# Altium project HU_revB.PrjPcb (part 2 of 2)

## Sheet NVME.SchDoc
size C; SheetNumber: 6; SheetTotal: 17
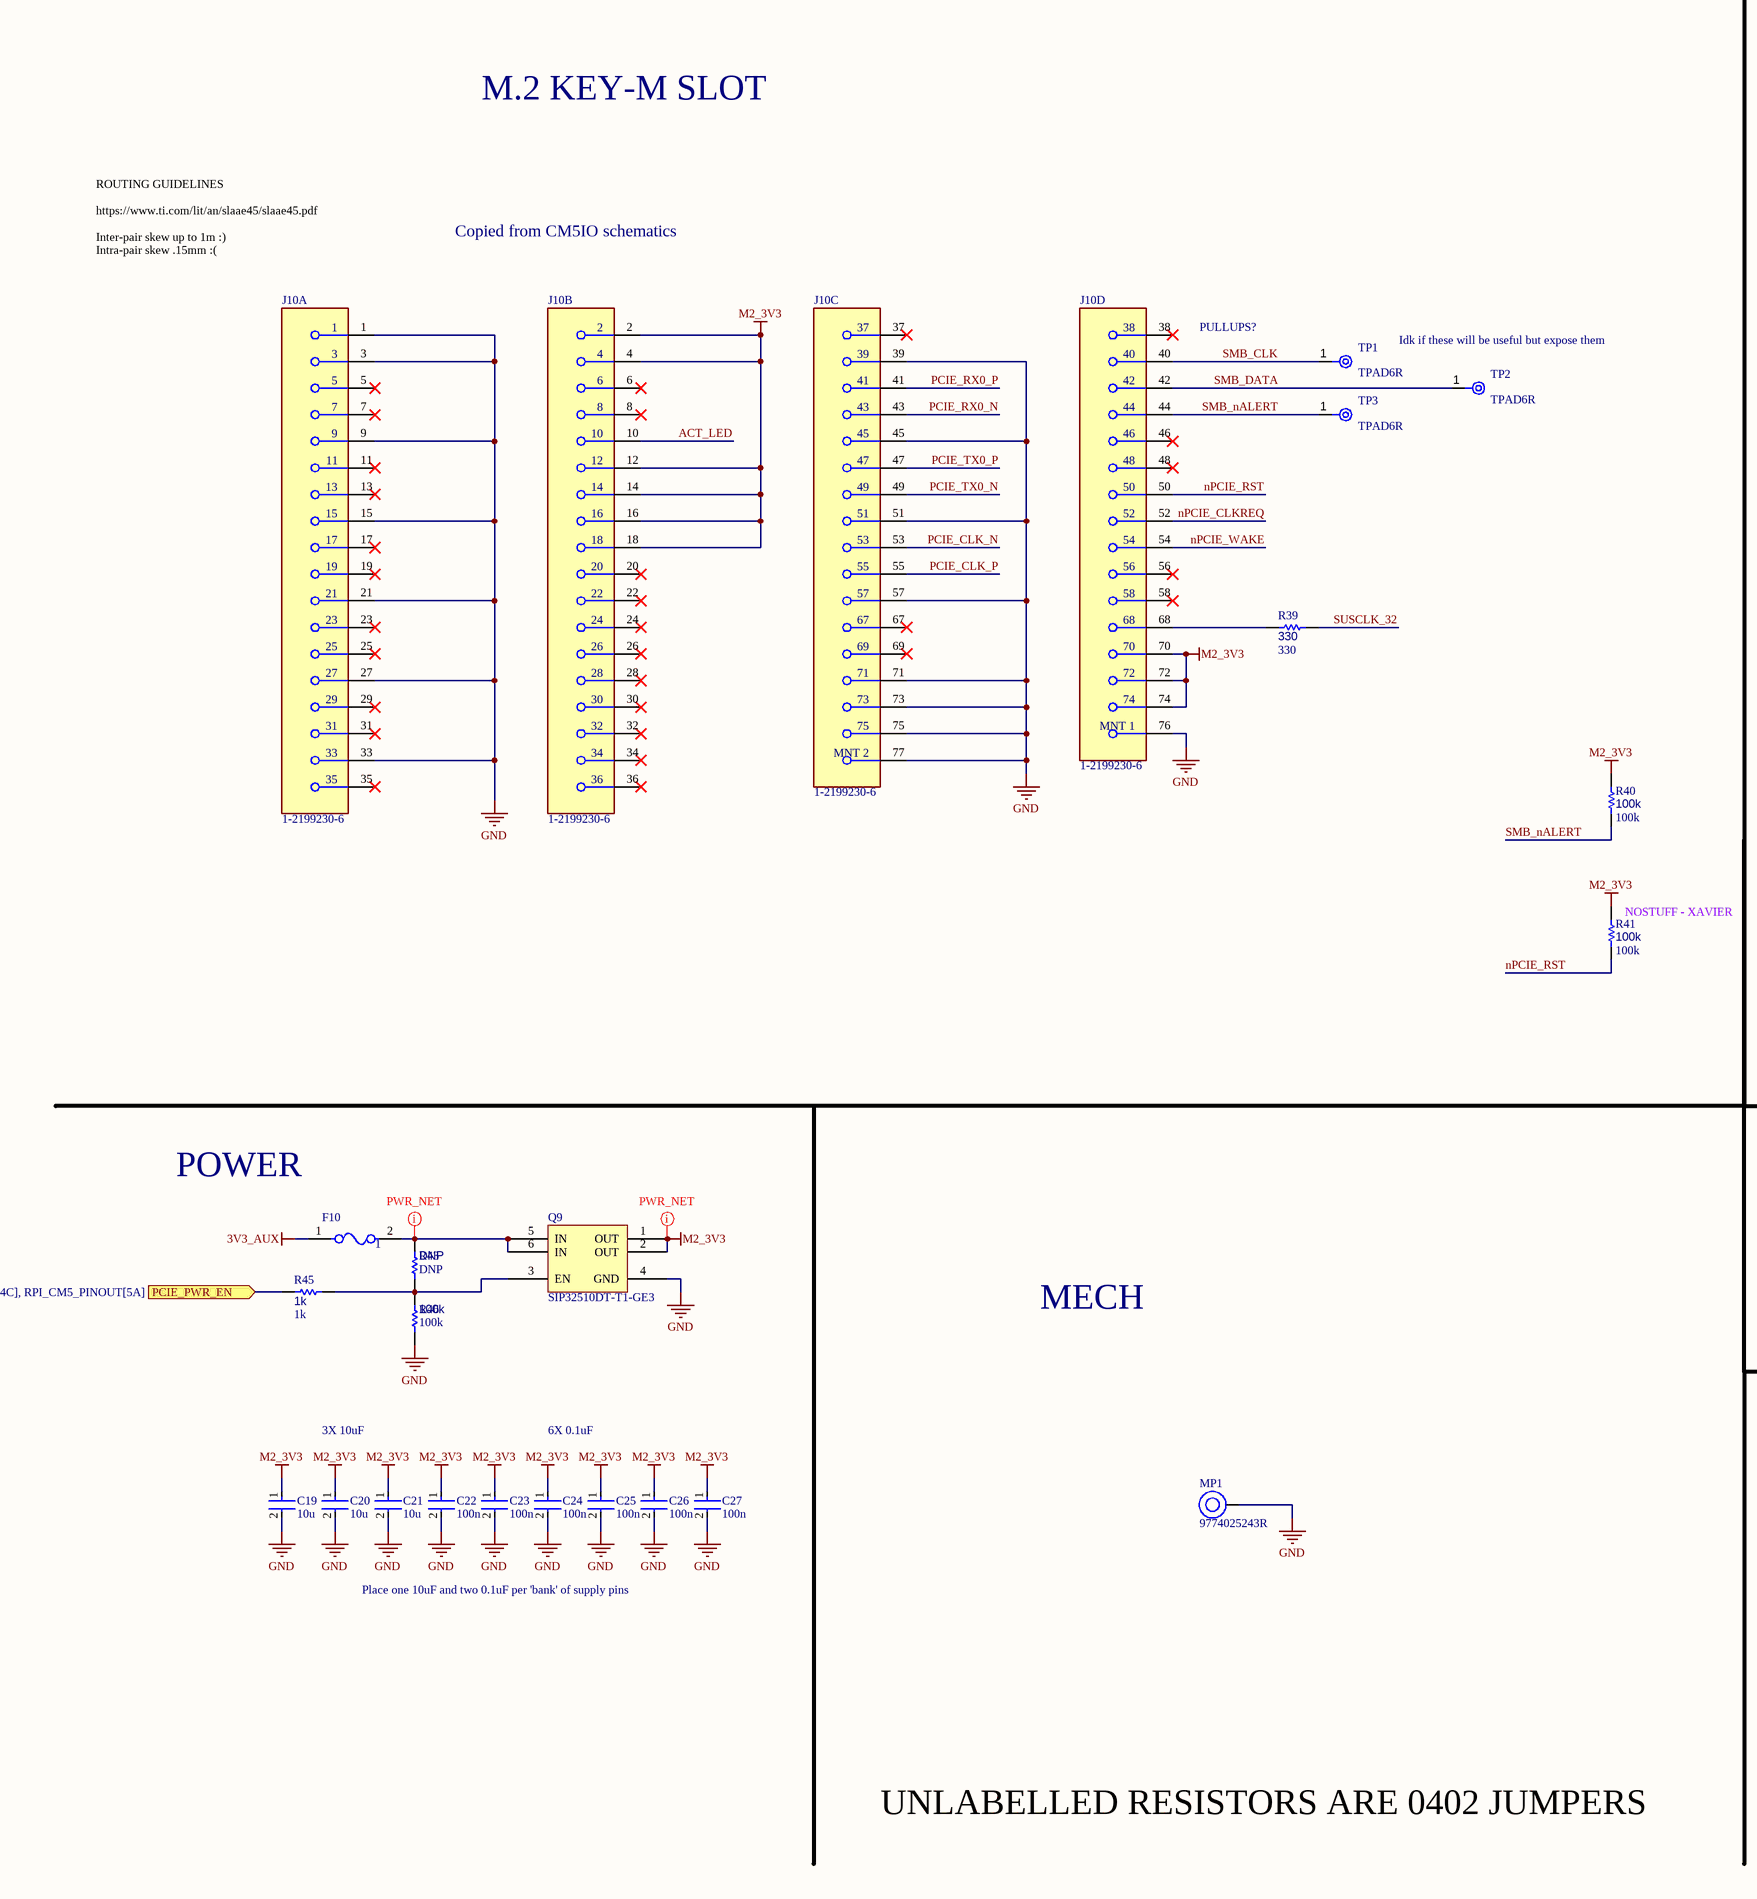
[diagram p6: NVME.SchDoc, left]
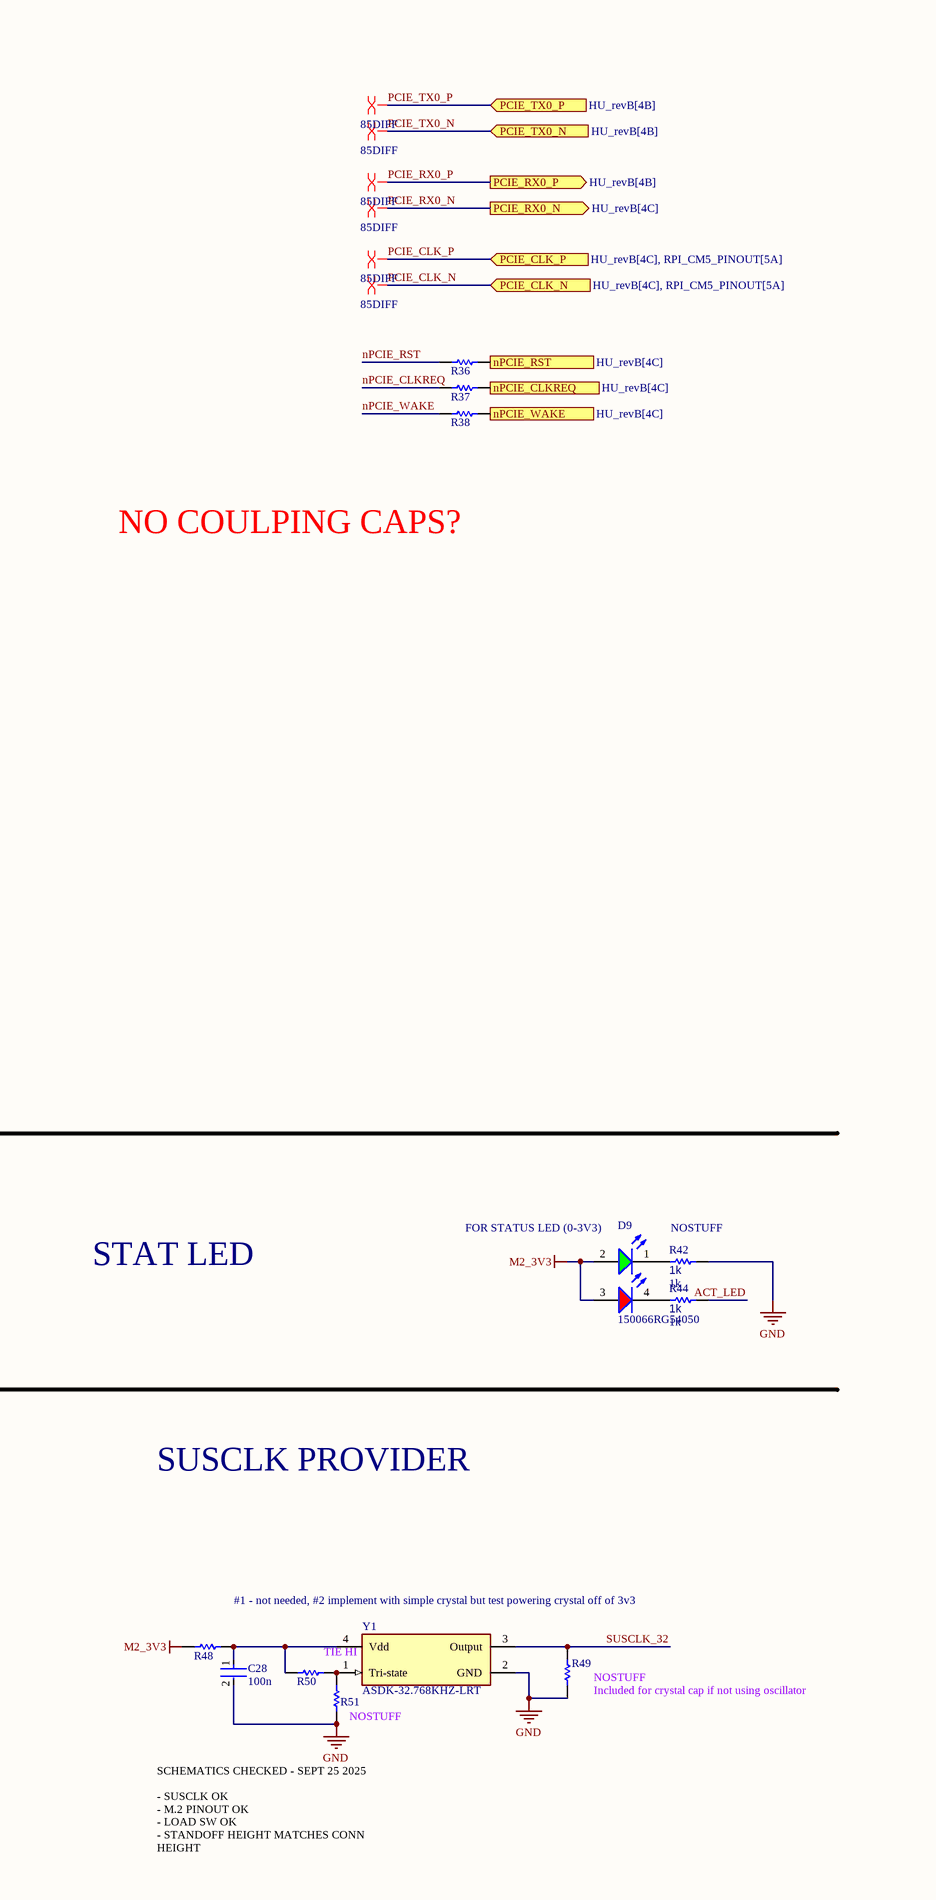
[diagram p7: NVME.SchDoc, right]

### Parts
C19  10u  [FP-0402-L_1_0_0_05-W_0_5-IPC_A]
C20  10u  [FP-0402-L_1_0_0_05-W_0_5-IPC_A]
C21  10u  [FP-0402-L_1_0_0_05-W_0_5-IPC_A]
C22  100n  [FP-0402-L_1_0_0_05-W_0_5-IPC_A]
C23  100n  [FP-0402-L_1_0_0_05-W_0_5-IPC_A]
C24  100n  [FP-0402-L_1_0_0_05-W_0_5-IPC_A]
C25  100n  [FP-0402-L_1_0_0_05-W_0_5-IPC_A]
C26  100n  [FP-0402-L_1_0_0_05-W_0_5-IPC_A]
C27  100n  [FP-0402-L_1_0_0_05-W_0_5-IPC_A]
C28  100n  [FP-0402-L_1_0_0_05-W_0_5-IPC_A]
D9  150066RG54050  [WL-SBCD_0606]
F10  1  [FP-0685T-MFG]
J10  1-2199230-6  [FP-1-2199230-6-MFG]  (parts A,B,C,D of 4)
MP1  9774025243R  [9774025243]
Q9  SIP32510DT-T1-GE3  [SOT95P284X110-6N]
R36  0402 JUMPER  [RESC1005X40X25ML05T05]  (value not drawn)
R37  0402 JUMPER  [RESC1005X40X25ML05T05]  (value not drawn)
R38  0402 JUMPER  [RESC1005X40X25ML05T05]  (value not drawn)
R39  330  [R0603B]
R40  100k  [R0603B]
R41  100k  [R0603B]
R42  1k  [R0603B]
R43  DNP  [R0603B]
R44  1k  [R0603B]
R45  1k  [R0603B]
R46  100k  [R0603B]
R48  0402 JUMPER  [RESC1005X40X25ML05T05]  (value not drawn)
R49  0402 JUMPER  [RESC1005X40X25ML05T05]  (value not drawn)
R50  0402 JUMPER  [RESC1005X40X25ML05T05]  (value not drawn)
R51  0402 JUMPER  [RESC1005X40X25ML05T05]  (value not drawn)
TP1  TPAD6R  [New footprint 1]
TP2  TPAD6R  [New footprint 1]
TP3  TPAD6R  [New footprint 1]
Y1  ASDK-32.768KHZ-LRT  [FP-ASDK-MFG]

### Ports
nPCIE_CLKREQ (out, see HU_revB[4C]), nPCIE_RST (in, see HU_revB[4C]), nPCIE_WAKE (out, see HU_revB[4C]), PCIE_CLK_N (in, see HU_revB[4C], RPI_CM5_PINOUT[5A]), PCIE_CLK_P (in, see HU_revB[4C], RPI_CM5_PINOUT[5A]), PCIE_PWR_EN (in, see HU_revB[4C], RPI_CM5_PINOUT[5A]), PCIE_RX0_N (out, see HU_revB[4C]), PCIE_RX0_P (out, see HU_revB[4B]), PCIE_TX0_N (in, see HU_revB[4B]), PCIE_TX0_P (in, see HU_revB[4B])

### Nets
3V3_AUX: F10.1
GND: C19.2 C20.2 C21.2 C22.2 C23.2 C24.2 C25.2 C26.2 C27.2 C28.2 J10.1 J10.3 J10.9 J10.15 J10.21 J10.27 J10.33 J10.39 J10.45 J10.51 J10.57 J10.71 J10.73 J10.75 J10.76(MNT_1) J10.77(MNT_2) MP1.1 Q9.4(GND) R42.2 R46.1 R49.1 R51.1 Y1.2(GND)
M2_3V3: C19.1 C20.1 C21.1 C22.1 C23.1 C24.1 C25.1 C26.1 C27.1 D9.2(A) D9.3(A) J10.2 J10.4 J10.12 J10.14 J10.16 J10.18 J10.70 J10.72 J10.74 Q9.1(OUT) Q9.2(OUT) R40.1 R41.1 R48.1
ACT_LED: J10.10 R44.2
nPCIE_CLKREQ: J10.52 R37.1
nPCIE_RST: J10.50 R36.1 R41.2
nPCIE_WAKE: J10.54 R38.1
PCIE_CLK_N: J10.53 ; port PCIE_CLK_N
PCIE_CLK_P: J10.55 ; port PCIE_CLK_P
PCIE_RX0_N: J10.43 ; port PCIE_RX0_N
PCIE_RX0_P: J10.41 ; port PCIE_RX0_P
PCIE_TX0_N: J10.49 ; port PCIE_TX0_N
PCIE_TX0_P: J10.47 ; port PCIE_TX0_P
SMB_CLK: J10.40 TP1.1(TP)
SMB_DATA: J10.42 TP2.1(TP)
SMB_nALERT: J10.44 R40.2 TP3.1(TP)
SUSCLK_32: R39.1 R49.2 Y1.3(Output)
NetC28_1: C28.1 R48.2 R50.1 Y1.4(Vdd)
NetD9_1: D9.1(K) R42.1
NetD9_4: D9.4(K) R44.1
NetF10_2: F10.2 Q9.5(IN) Q9.6(IN) R43.2
NetJ10_68: J10.68 R39.2
NetQ9_3: Q9.3(EN) R43.1 R45.1 R46.2
NetR36_2: R36.2 ; port nPCIE_RST
NetR37_2: R37.2 ; port nPCIE_CLKREQ
NetR38_2: R38.2 ; port nPCIE_WAKE
NetR45_2: R45.2 ; port PCIE_PWR_EN
NetR50_2: R50.2 R51.2 Y1.1(Tri-state)

Not connected (* = marked no-connect by the designer): J10 5* 6* 7* 8* 11* 13* 17* 19* 20* 22* 23* 24* 25* 26* 28* 29* 30* 31* 32* 34* 35* 36* 37* 38* 46* 48* 56* 58* 67* 69*

### Layout directives
differential pair; differential pair class 85DIFF: PCIE_CLK_N, PCIE_CLK_P, PCIE_RX0_N, PCIE_RX0_P, PCIE_TX0_N, PCIE_TX0_P
net class PWR: M2_3V3, NetF10_2

### Notes on the sheet
- M.2 KEY-M SLOT
- ROUTING GUIDELINES
  https://www.ti.com/lit/an/slaae45/slaae45.pdf
  Inter-pair skew up to 1m :)
  Intra-pair skew .15mm :(
- Copied from CM5IO schematics
- PULLUPS?
- (near TP2) Idk if these will be useful but expose them
- NO COULPING CAPS?
- (near R41) NOSTUFF - XAVIER
- POWER
- STAT LED
- (near D9) FOR STATUS LED (0-3V3)
- (near R42) NOSTUFF
- MECH
- 3X 10uF
- 6X 0.1uF
- SUSCLK PROVIDER
- Place one 10uF and two 0.1uF per 'bank' of supply pins
- #1 - not needed, #2 implement with simple crystal but test powering crystal off of 3v3
- (near Y1) TIE HI
- (near R51) NOSTUFF
- (near R49) NOSTUFF
- (near R49) Included for crystal cap if not using oscillator
- UNLABELLED RESISTORS ARE 0402 JUMPERS
- SCHEMATICS CHECKED - SEPT 25 2025
  - SUSCLK OK
  - M.2 PINOUT OK
  - LOAD SW OK
  - STANDOFF HEIGHT MATCHES CONN HEIGHT

### Library data of the parts
C19-C28 = CMP-001-00058-1: LARGE PADS, 0402 CAP, CHANGE COMMENT TO MATCH REAL P/N; Capacitor Type: Ceramic; Min Operating Temperature: -55°C; Mounting Technology: Surface Mount; Pins: 2; Case/Package: 0402; RoHS Compliant: Yes; Max Operating Temperature: 85°C
D9 = CMP-004-00040-2: Led, Red/Grn, 180Mcd/230Mcd, 624Nm/525Nm Rohs Compliant: Yes; Source: rgled.SchLib; Component Type: Standard; Pins: 4; Design Item ID: CMP-004-00034-2
F10 = CMP-16042-000006-1: FUSE BOARD MNT 5A 63VAC/VDC 1206; RoHS Compliant: Yes
J10 = CMP-03365-000001-1: CONN EDGE DUAL FMALE 67POS 0.020; Manufacturer: TE; Number Of Contacts: 67; Current Rating: 0.5A; Pitch: 0.5mm; Conn Gender: Female; Is Female: yes; Voltage Rating: 50V; Conn Orientation: Right Angle; Automotive: No; Temperature Range High: +80°C; Package: 1-2199230-6; Category: Conn; Temperature: -40°C to +80°C; Number Of Rows: 2; ComponentLink2URL: http://www.te.com/commerce/DocumentDelivery/DDEController?Action=showdoc&DocId=Specification+Or+Standard%7F114-115006%7FB%7Fpdf%7FEnglish%7FENG_SS_114-115006_B_114-115006_REV_B.pdf%7F1-2199230-6; Manufacturer Part Number: 1-2199230-6; Height: 4.2mm; RoHS: TRUE; Footprint Url: http://www.te.com/commerce/DocumentDelivery/DDEController?Action=showdoc&DocId=Customer+Drawing%7F2199230%7FB2%7Fpdf%7FEnglish%7FENG_CD_2199230_B2.pdf%7F1-2199230-6; Digikey Description: CONN EDGE DUAL FMALE 67POS 0.020; Device Class L2: Card Edge Connectors; Contact Material: Gold,Tin; Device Class L1: Connectors; Device Class L3: unset; ComponentLink2Description: Datasheet; Temperature Range Low: -40°C; Octopart: https://octopart.com/1-2199230-6-te+connectivity-34969376; Lead Free: Yes
MP1 = CMP-03913-59774857-1: 9774025243R Spacer Material: Steel, Tin-Plated Mounting: SMT Series: WA-SMST Thread D: M2; Outside Diameter: 4.3434mm; Threaded/Unthreaded: Threaded; Plating: Tin; REACH SVHC: Unknown; NexarPartId: 59774857; RoHS: Compliant; Material: Steel; Packaging: Tape and Reel; Max Operating Temperature: 150°C; Min Operating Temperature: -55°C; Length: 2.5mm; Height: 2.5mm
Q9 = CMP-019-00054-1: Power Switch ICs – Power Distribution; VISHAY; SIP32510DT-T1-GE3; 1; 1; 5.5 V; SOT-23-6; Max Supply Voltage: 5.5V; Max Power Dissipation: 833mW; Min Supply Voltage: 1.2V; Case/Package: SOT-23-6; Mounting Technology: Surface Mount; Max Operating Temperature: 85°C; Min Operating Temperature: -40°C
R36-R38 R48-R51 = CMP-009-00118-2: READ THE NAME; Pins: 2; Component Type: Standard; Design Item ID: CMP-009-00206-2; Source: 0402jump.SchLib
R39-R46 = CMP-009-00002-14: Resistor
  R39: Value: 330
  R40 R41 R46: Value: 100k
  R42 R44 R45: Value: 1k
  R43: Value: DNP
TP1-TP3 = CMP-00025-2: Test Point .6mm
Y1 = CMP-27762-001115-1: XTAL OSC XO 32.7680KHZ CMOS SMD; Load Capacitance: 15pF; Max Supply Current: 3.5mA; Min Supply Voltage: 2.97V; Operating Supply Voltage: 3.3V; Frequency Stability: 25ppm; Lead Free: Lead Free; Case/Package: CSMD; Number of Pins: 4; Max Operating Temperature: 85°C; Packaging: Tape and Reel; Width: 0.079inch; Min Operating Temperature: -40°C; Radiation Hardening: No; Length: 2.5mm; Depth: 2mm; Termination: SMD/SMT; Height: 0.037inch; Series: ASDK; Frequency: 32.768kHz; Mount: Surface Mount

## Sheet MCP2515_PINOUT.SchDoc
size A; SheetNumber: 7; SheetTotal: 17
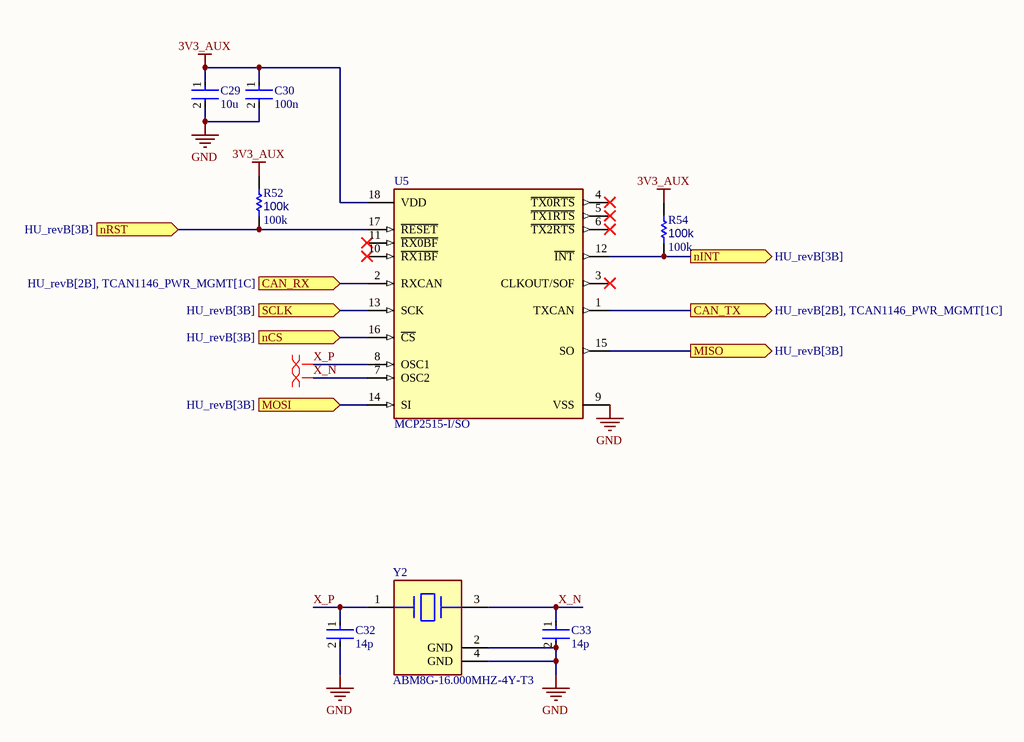
[diagram p8: MCP2515_PINOUT.SchDoc]

### Parts
C29  10u  [FP-0402-L_1_0_0_05-W_0_5-IPC_A]
C30  100n  [FP-0402-L_1_0_0_05-W_0_5-IPC_A]
C32  14p  [FP-0402-L_1_0_0_05-W_0_5-IPC_A]
C33  14p  [FP-0402-L_1_0_0_05-W_0_5-IPC_A]
R52  100k  [R0603B]
R54  100k  [R0603B]
U5  MCP2515-I/SO  [FP-C04-051-MFG]
Y2  ABM8G-16.000MHZ-4Y-T3  [FP-ABM8G-MFG]

### Ports
CAN_RX (in, see HU_revB[2B], TCAN1146_PWR_MGMT[1C]), CAN_TX (out, see HU_revB[2B], TCAN1146_PWR_MGMT[1C]), MISO (out, see HU_revB[3B]), MOSI (in, see HU_revB[3B]), nCS (in, see HU_revB[3B]), nINT (out, see HU_revB[3B]), nRST (in, see HU_revB[3B]), SCLK (in, see HU_revB[3B])

### Nets
3V3_AUX: C29.1 C30.1 R52.1 R54.1 U5.18(VDD)
GND: C29.2 C30.2 C32.2 C33.2 U5.9(VSS) Y2.2(GND) Y2.4(GND)
X_N: C33.1 U5.7(OSC2) Y2.3
X_P: C32.1 U5.8(OSC1) Y2.1
NetR52_2: R52.2 U5.17(~{RESET}) ; port nRST
NetR54_2: R54.2 U5.12(~{INT}) ; port nINT
NetU2_1: U5.1(TXCAN) ; port CAN_TX
NetU2_4: U5.2(RXCAN) ; port CAN_RX
NetU5_13: U5.13(SCK) ; port SCLK
NetU5_14: U5.14(SI) ; port MOSI
NetU5_15: U5.15(SO) ; port MISO
NetU5_16: U5.16(~{CS}) ; port nCS

Not connected (* = marked no-connect by the designer): U5 3(CLKOUT/SOF)* 4(~{TX0RTS})* 5(~{TX1RTS})* 6(~{TX2RTS})* 10(~{RX1BF})* 11(~{RX0BF})*

### Layout directives
differential pair: X_N, X_P

### Library data of the parts
C29 C30 C32 C33 = CMP-001-00058-1: as C19 on sheet NVME; Min Operating Temperature: -55°C; Mounting Technology: Surface Mount; Pins: 2; Case/Package: 0402; RoHS Compliant: Yes; Max Operating Temperature: 85°C
R52 R54 = CMP-009-00002-14: Resistor; Value: 100k
U5 = CMP-0186-00133-3: IC CAN CONTROLLER W/SPI 18SOIC; Manufacturer: Microchip; Min Supply Voltage: 2.7V; Max Supply Voltage: 5.5V; Standoff Height: 0.1mm; Nominal Supply Current: 10mA; Interface: SPI,CAN; Lead Free: Yes; Digikey Description: IC CAN CONTROLLER W/SPI 18SOIC; Category: IC; RoHS: TRUE; Manufacturer Part Number: MCP2515-I/SO; ComponentLink2URL: http://ww1.microchip.com/downloads/en/DeviceDoc/MCP2515-Stand-Alone-CAN-Controller-with-SPI-20001801J.pdf; Mouser Description: CAN Interface IC W/ SPI Interface; Device Class L2: Interface ICs; Package: C04-051; Automotive: No; Function: Controller; Octopart: https://octopart.com/mcp2515-i%2Fso-microchip-430187; Temperature: -40°C to +85°C; Ipc Land Pattern Name: SOIC127P1030X265-18; Ambient Temperature Range Low: -65°C; Height: 2.65mm; Device Class L1: Integrated Circuits (ICs); Ambient Temperature Range High: +125°C; Footprint Url: http://ww1.microchip.com/downloads/en/DeviceDoc/18L_SOIC_Wide_7.50_SO_C04-0051D.pdf; Temperature Range Low: -40°C; Device Class L3: Controllers; Temperature Range High: +85°C; ComponentLink2Description: Datasheet
Y2 = CMP-27762-015134-1: Crystal 16MHz ±30ppm (Tol) ±30ppm (Stability) 10pF FUND 80Ω 4-Pin SMD T/R; Series Resistance: 80R; Mount: Surface Mount; Width: 0.098inch; Load Capacitance: 10pF; Length: 3.2mm; Series: ABM8G; Max Operating Temperature: 60°C; Depth: 2.5mm; Frequency: 16MHz; Frequency Tolerance: 30ppm; Height: 0.039inch; ESR (Equivalent Series Resistance): 80R; Case/Package: SMD/SMT; Lead Free: Lead Free; Frequency Stability: 30ppm; Packaging: Tape and Reel; Number of Pins: 4; REACH SVHC: No SVHC; Min Operating Temperature: -10°C

## Sheet ADC108S022_PINOUT.SchDoc
size A; SheetNumber: 7; SheetTotal: 17
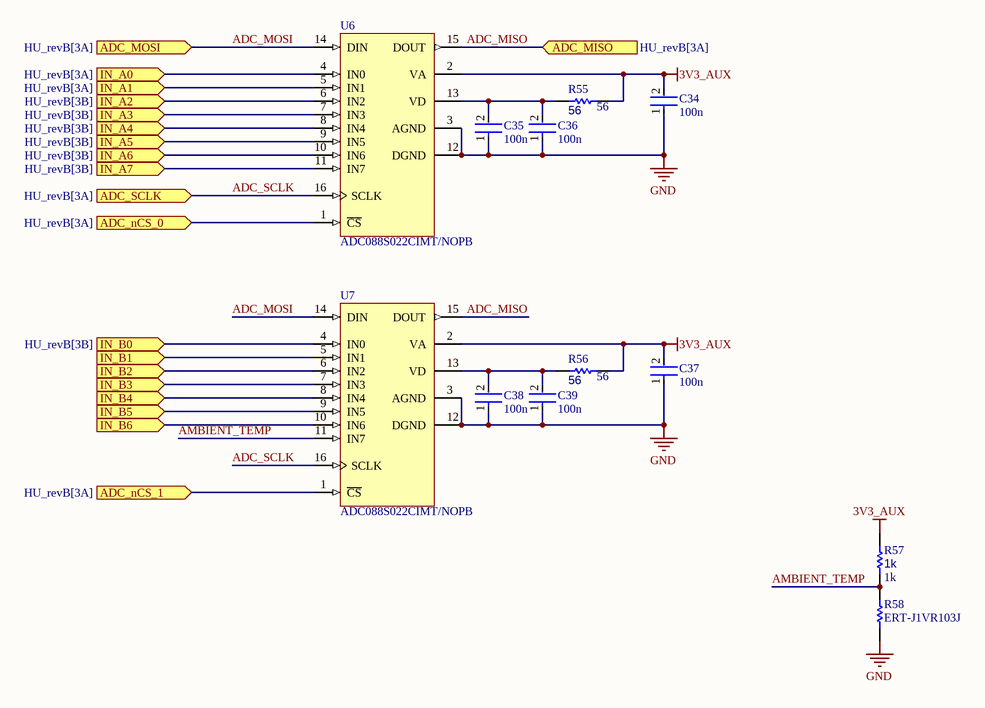
[diagram p9: ADC108S022_PINOUT.SchDoc]

### Parts
C34  100n  [FP-0402-L_1_0_0_05-W_0_5-IPC_A]
C35  100n  [FP-0402-L_1_0_0_05-W_0_5-IPC_A]
C36  100n  [FP-0402-L_1_0_0_05-W_0_5-IPC_A]
C37  100n  [FP-0402-L_1_0_0_05-W_0_5-IPC_A]
C38  100n  [FP-0402-L_1_0_0_05-W_0_5-IPC_A]
C39  100n  [FP-0402-L_1_0_0_05-W_0_5-IPC_A]
R55  56  [R0603B]
R56  56  [R0603B]
R57  1k  [R0603B]
R58  ERT-J1VR103J  [RESC1608X90X30ML15T20]
U6  ADC088S022CIMT/NOPB  [MTC16_L]
U7  ADC088S022CIMT/NOPB  [MTC16_L]

### Ports
ADC_MISO (in, see HU_revB[3A]), ADC_MOSI (in, see HU_revB[3A]), ADC_nCS_0 (in, see HU_revB[3A]), ADC_nCS_1 (in, see HU_revB[3A]), ADC_SCLK (in, see HU_revB[3A]), IN_A0 (in, see HU_revB[3A]), IN_A1 (in, see HU_revB[3A]), IN_A2 (in, see HU_revB[3B]), IN_A3 (in, see HU_revB[3B]), IN_A4 (in, see HU_revB[3B]), IN_A5 (in, see HU_revB[3B]), IN_A6 (in, see HU_revB[3B]), IN_A7 (in, see HU_revB[3B]), IN_B0 (in, see HU_revB[3B]), IN_B1 (in), IN_B2 (in), IN_B3 (in), IN_B4 (in), IN_B5 (in), IN_B6 (in)

### Nets
3V3_AUX: C34.2 C37.2 R55.1 R56.1 R57.1 U6.2(VA) U7.2(VA)
GND: C34.1 C35.1 C36.1 C37.1 C38.1 C39.1 R58.1 U6.3(AGND) U6.12(DGND) U7.3(AGND) U7.12(DGND)
ADC_MISO: U6.15(DOUT) U7.15(DOUT) ; port ADC_MISO
ADC_MOSI: U6.14(DIN) U7.14(DIN) ; port ADC_MOSI
ADC_SCLK: U6.16(SCLK) U7.16(SCLK) ; port ADC_SCLK
AMBIENT_TEMP: R57.2 R58.2 U7.11(IN7)
AMP_I_SENSE: U7.4(IN0) ; port IN_B0
NetC35_2: C35.2 C36.2 R55.2 U6.13(VD)
NetC38_2: C38.2 C39.2 R56.2 U7.13(VD)
NetD2_1: U6.4(IN0) ; port IN_A0
NetR10_1: U6.5(IN1) ; port IN_A1
NetR28_2: U6.8(IN4) ; port IN_A4
NetR32_1: U6.7(IN3) ; port IN_A3
NetR34_1: U6.6(IN2) ; port IN_A2
NetR84_2: U6.11(IN7) ; port IN_A7
NetR88_1: U6.10(IN6) ; port IN_A6
NetR90_1: U6.9(IN5) ; port IN_A5
NetU6_1: U6.1(~{CS}) ; port ADC_nCS_0
NetU7_1: U7.1(~{CS}) ; port ADC_nCS_1
NetU7_5: U7.5(IN1) ; port IN_B1
NetU7_6: U7.6(IN2) ; port IN_B2
NetU7_7: U7.7(IN3) ; port IN_B3
NetU7_8: U7.8(IN4) ; port IN_B4
NetU7_9: U7.9(IN5) ; port IN_B5
NetU7_10: U7.10(IN6) ; port IN_B6

### Library data of the parts
C34-C39 = CMP-001-00058-1: as C19 on sheet NVME; Min Operating Temperature: -55°C; Mounting Technology: Surface Mount; Pins: 2; Case/Package: 0402; RoHS Compliant: Yes; Max Operating Temperature: 85°C
R55-R57 = CMP-009-00002-14: Resistor
  R55 R56: Value: 56
  R57: Value: 1k
R58 = CMP-2000-00869-1: Manufacturer: Panasonic; Part Number: ERT-J1VR103J
U6 U7 = CMP-0054-00372-2: 8-Channel, 50 kSPS to 200 kSPS, 8-Bit A/D Converter, 16-pin TSSOP, Pb-Free; Manufacturer: National Semiconductor; PackageTopMarking: NSUZXYTT*88S022*CIMT; CompType: ADC IC; PowerWise: Y; ComponentLink2URL: http://www.national.com/pf/AD/ADC088S022.html; RoHS: Y; PackageDescription: Molded TSSOP, Jedec, 5 x 4.4 x 0.9mm Body, 16 Lead, 0.65mm Pitch; DatasheetVersion: Feb-2010; PinCount: 16; ComponentLink1Description: ADC088S022 Datasheet; Code_JEDEC: MO-153-AB; ComponentLink3URL: http://www.national.com/packaging/folders/mtc16.html; PackageVersion: revD, Jun-2003; ComponentLink3Description: MTC16 Package Page; RevisionNote: Component URLs added; ComponentLink1URL: http://www.national.com/ds/AD/ADC088S022.pdf; ComponentLink2Description: ADC088S022 Web Page; PackageReference: MTC16

## Sheet SD.SchDoc
size A4; SheetNumber: 9; SheetTotal: 17
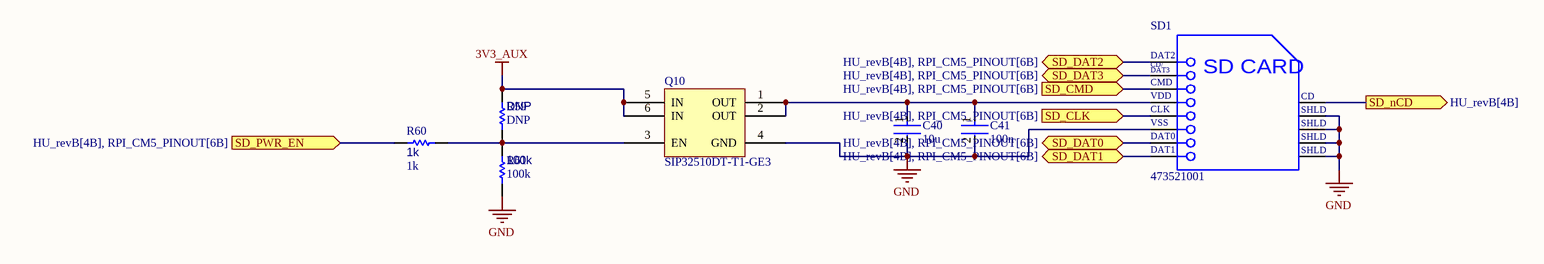
[diagram p10: SD.SchDoc]

### Parts
C40  10u  [FP-0402-L_1_0_0_05-W_0_5-IPC_A]
C41  100n  [FP-0402-L_1_0_0_05-W_0_5-IPC_A]
Q10  SIP32510DT-T1-GE3  [SOT95P284X110-6N]
R59  DNP  [R0603B]
R60  1k  [R0603B]
R61  100k  [R0603B]
SD1  473521001  [MOLX-473521001_V]

### Ports
SD_CLK (in, see HU_revB[4B], RPI_CM5_PINOUT[6B]), SD_CMD (in, see HU_revB[4B], RPI_CM5_PINOUT[6B]), SD_DAT0 (bidir, see HU_revB[4B], RPI_CM5_PINOUT[6B]), SD_DAT1 (bidir, see HU_revB[4B], RPI_CM5_PINOUT[6B]), SD_DAT2 (bidir, see HU_revB[4B], RPI_CM5_PINOUT[6B]), SD_DAT3 (bidir, see HU_revB[4B], RPI_CM5_PINOUT[6B]), SD_nCD (out, see HU_revB[4B]), SD_PWR_EN (in, see HU_revB[4B], RPI_CM5_PINOUT[6B])

### Nets
3V3_AUX: Q10.5(IN) Q10.6(IN) R59.2
GND: C40.2 C41.2 Q10.4(GND) R61.1 SD1.6(VSS) SD1.10(SHLD) SD1.11(SHLD) SD1.12(SHLD) SD1.13(SHLD)
NetC40_1: C40.1 C41.1 Q10.1(OUT) Q10.2(OUT) SD1.4(VDD)
NetQ10_3: Q10.3(EN) R59.1 R60.1 R61.2
NetR60_2: R60.2 ; port SD_PWR_EN
NetSD1_1: SD1.1(DAT2) ; port SD_DAT2
NetSD1_2: SD1.2(CD/DAT3) ; port SD_DAT3
NetSD1_3: SD1.3(CMD) ; port SD_CMD
NetSD1_5: SD1.5(CLK) ; port SD_CLK
NetSD1_7: SD1.7(DAT0) ; port SD_DAT0
NetSD1_8: SD1.8(DAT1) ; port SD_DAT1
NetSD1_9: SD1.9(CD) ; port SD_nCD

### Notes on the sheet
- (in symbol CMP-2000-05848-1) CD/; DAT3; SD CARD

### Library data of the parts
C40 C41 = CMP-001-00058-1: as C19 on sheet NVME; Min Operating Temperature: -55°C; Mounting Technology: Surface Mount; Pins: 2; Case/Package: 0402; RoHS Compliant: Yes; Max Operating Temperature: 85°C
Q10 = CMP-019-00054-1: as Q9 on sheet NVME; Case/Package: SOT-23-6; Mounting Technology: Surface Mount; Max Operating Temperature: 85°C; Min Operating Temperature: -40°C
R59-R61 = CMP-009-00002-14: Resistor
  R59: Value: DNP
  R60: Value: 1k
  R61: Value: 100k
SD1 = CMP-2000-05848-1: MicroSD(TM), Pitch 1.1 mm, 8 Position, Height 1.88 mm, -20 to 85 degC, RoHS, Tape and Reel; Manufacturer: Molex; Datasheet Version: Rev. G, 01/2012; Datasheet URL: http://www.molex.com/pdm_docs/sd/473521001_sd.pdf; Package Reference: 473521001; Manufacturer URL: http://www.molex.com/; Mounting Technology: SurfaceMount; Package Description: MicroSD(TM), Pitch 1.1 mm, 8 Position, Height 1.88 mm

## Sheet 3V3_REG.SchDoc
size B; SheetNumber: 12; SheetTotal: 17
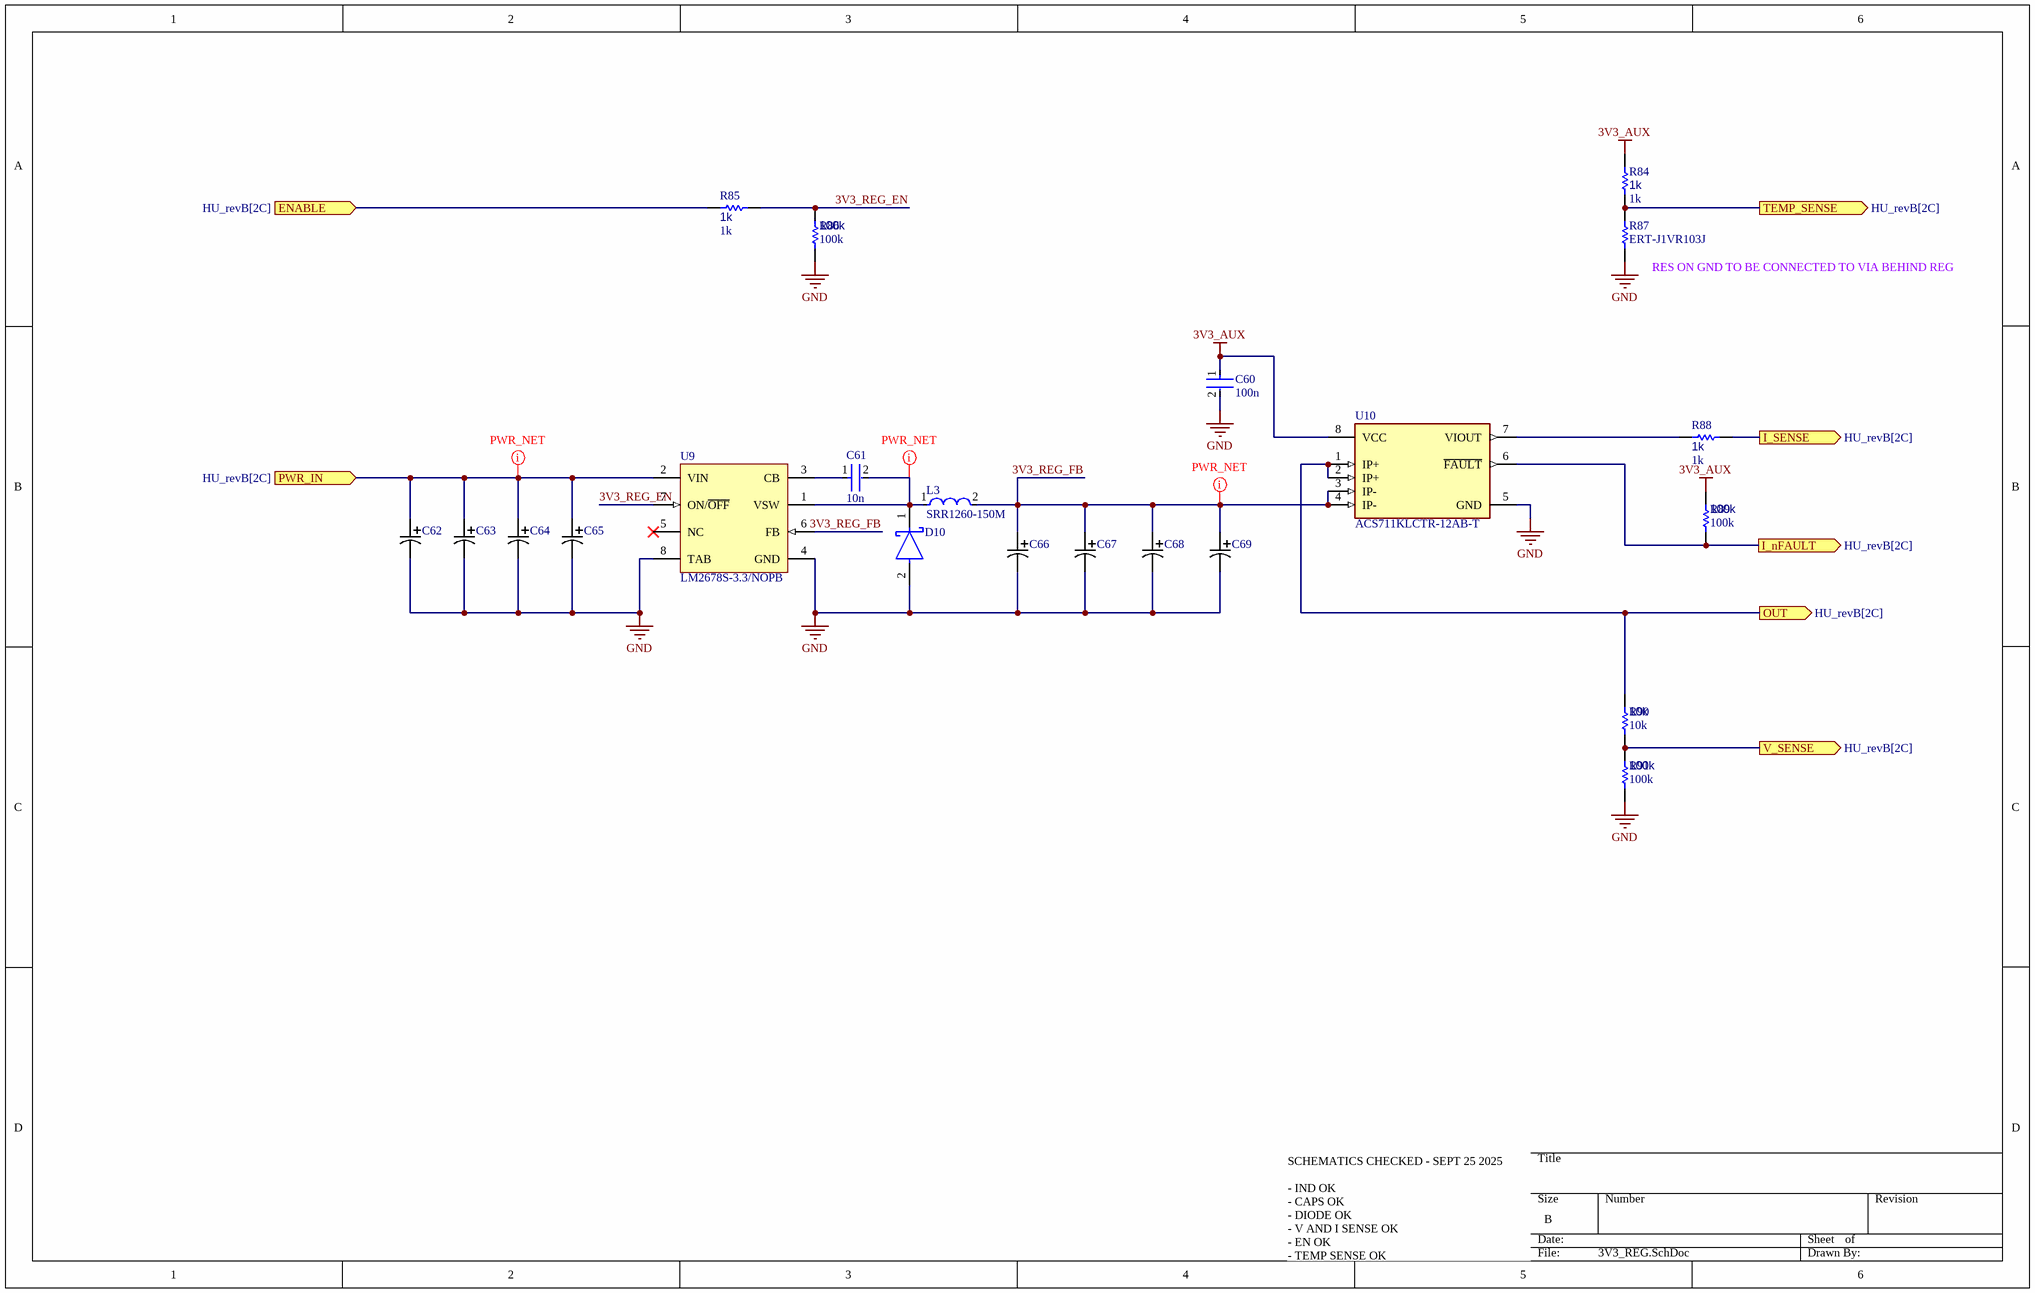
[diagram p11: 3V3_REG.SchDoc]

### Parts
C60  100n  [FP-0402-L_1_0_0_05-W_0_5-IPC_A]
C61  10n  [FP-0402-L_1_0_0_05-W_0_5-IPC_A]
C62  T495D475K050ATE300  [T495D475K050ATE300-Footprint-1]  (value not drawn)
C63  T495D475K050ATE300  [T495D475K050ATE300-Footprint-1]  (value not drawn)
C64  T495D475K050ATE300  [T495D475K050ATE300-Footprint-1]  (value not drawn)
C65  T495D475K050ATE300  [T495D475K050ATE300-Footprint-1]  (value not drawn)
C66  T495D337K010ATE150  [T495D337K010ATE150-Footprint-1]  (value not drawn)
C67  T495D337K010ATE150  [T495D337K010ATE150-Footprint-1]  (value not drawn)
C68  T495D337K010ATE150  [T495D337K010ATE150-Footprint-1]  (value not drawn)
C69  T495D337K010ATE150  [T495D337K010ATE150-Footprint-1]  (value not drawn)
D10  B540C-13-F  [FP-SMC-MFG]  (value not drawn)
L3  SRR1260-150M  [FP-SRR1260-MFG]
R84  1k  [R0603B]
R85  1k  [R0603B]
R86  100k  [R0603B]
R87  ERT-J1VR103J  [RESC1608X90X30ML15T20]
R88  1k  [R0603B]
R89  100k  [R0603B]
R90  10k  [R0603B]
R91  100k  [R0603B]
U9  LM2678S-3.3/NOPB  [KTW0007B_N]
U10  ACS711KLCTR-12AB-T  [FP-LC-8-IPC_C]

### Ports
ENABLE (in, see HU_revB[2C]), I_nFAULT (out, see HU_revB[2C]), I_SENSE (out, see HU_revB[2C]), OUT (out, see HU_revB[2C]), PWR_IN (in, see HU_revB[2C]), TEMP_SENSE (out, see HU_revB[2C]), V_SENSE (out, see HU_revB[2C])

### Nets
3V3_AUX: C60.1 R84.1 R89.2 R90.2 U10.1(IP+) U10.2(IP+) U10.8(VCC) ; port OUT
GND: C60.2 C62.2 C63.2 C64.2 C65.2 C66.2 C67.2 C68.2 C69.2 D10.2(A) R86.1 R87.1 R91.1 U9.4(GND) U9.8(TAB) U10.5(GND)
3V3_EN: R85.2 ; port ENABLE
3V3_REG_EN: R85.1 R86.2 U9.7(ON/~{OFF})
3V3_REG_FB: C66.1 C67.1 C68.1 C69.1 L3.2 U9.6(FB) U10.3(IP-) U10.4(IP-)
NetC61_1: C61.1 U9.3(CB)
NetC61_2: C61.2 D10.1(C) L3.1 U9.1(VSW)
NetC62_1: C62.1 C63.1 C64.1 C65.1 U9.2(VIN) ; port PWR_IN
NetR84_2: R84.2 R87.2 ; port TEMP_SENSE
NetR88_1: R88.1 ; port I_SENSE
NetR88_2: R88.2 U10.7(VIOUT)
NetR89_1: R89.1 U10.6(~{FAULT}) ; port I_nFAULT
NetR90_1: R90.1 R91.2 ; port V_SENSE

Not connected (* = marked no-connect by the designer): U9 5(NC)*

### Layout directives
net class PWR: 3V3_REG_FB, NetC61_2, NetC62_1

### Notes on the sheet
- (near R87) RES ON GND TO BE CONNECTED TO VIA BEHIND REG
- SCHEMATICS CHECKED - SEPT 25 2025
  - IND OK
  - CAPS OK
  - DIODE OK
  - V AND I SENSE OK
  - EN OK
  - TEMP SENSE OK

### Library data of the parts
C60 C61 = CMP-001-00058-1: as C19 on sheet NVME; Min Operating Temperature: -55°C; Mounting Technology: Surface Mount; Pins: 2; Case/Package: 0402; RoHS Compliant: Yes; Max Operating Temperature: 85°C
C62-C65 = CMP-001-00066-2: Cap Tant Solid 4.7uF 50V D CASE 10% (7.3 X 4.3 X 2.8mm) SMD 7343-31 0.3 Ohm 125 C T/R; Value: 4.7µF; Min Operating Temperature: -55°C; Voltage Rating: 50V; Tolerance: 10%; Mounting Technology: Surface Mount; Max Operating Temperature: 125°C; Case/Package: 7343-31; Pins: 2
C66-C69 = CMP-001-00067-2: 330uF Solid MnO2 Tantalum Capacitor, 10 V dc +/-10%, T495 Series; Tolerance: 10%; Voltage Rating: 10V; Value: 330µF; Case/Package: 2917; Min Operating Temperature: -55°C; Mounting Technology: Surface Mount; Max Operating Temperature: 125°C
D10 = CMP-2000-05097-3: DIODE SCHOTTKY 40V 5A SMC; Manufacturer: Diodes Inc.; Automotive Grade: NA; Peak Reverse Current: 0.5mA; Value: 300pF; Max Junction Temp: +150°C; Max Surge Forward Current: 100A; Standoff Height: 0.1mm; Digikey Description: DIODE SCHOTTKY 40V 5A SMC; Temperature Range Low: -55°C; Manufacturer Part Number: B540C-13-F; Octopart: https://octopart.com/b540c-13-f-diodes+inc.-325873; Lead Free: Yes; Reverse Voltage: 40V; RoHS: TRUE; Category: Diode; Mouser Description: Diode: Schottky rectifying; SMD; 40V; 5A; SMC; Package: reel, tape; ComponentLink2Description: Datasheet; Temperature Range High: +150°C; Automotive: No; Footprint Url: https://www.diodes.com/assets/Package-Files/SMC.pdf; Device Class L3: Schottky Diodes; Height: 2.5mm; Forward Current: 5A; Temperature: -55°C to +150°C; Package: SMC; ComponentLink2URL: https://www.diodes.com/assets/Datasheets/ds13012.pdf; Device Class L2: Diodes; Max Repetitive Reverse Voltage: 40V; Device Class L1: Discrete Semiconductors; Capacitance: 300pF
L3 = CMP-2000-07146-2: FIXED IND 15UH 5A 27 MOHM SMD; Q Factor: 25; Sample Rate (Hz): 100kHz; Resistance: 27MR; Material: Steel; Inductance Tolerance: 20%; Frequency: 17.6MHz; Saturation Current: 4.6A; Core Material: Ferrite; Shielding: Shielded; Series: SRR1260; Termination: SMD/SMT; Packaging: Tape and Reel; RoHS Compliant: Yes; Height - Seated (Max): 0.256inch; Depth: 12.8mm; Case/Package: 1260; Inductance: 15uH; Height: 6mm; Number of Pins: 2; Mount: Surface Mount; Min Operating Temperature: -40°C; Test Frequency: 100kHz; Length: 12.5mm; Self Resonant Frequency: 17.6MHz; Current Rating: 5A; Tolerance: 20%; RMS Current (Irms): 5A; REACH SVHC: No SVHC; Resistor Type: Wirewound; DC Resistance (DCR): 27mR; Width: 12.5mm; Package Quantity: 600; DC Current: 5A; Max DC Current: 5A; Max Operating Temperature: 125°C; Military Standard: Not
R84-R86 R88-R91 = CMP-009-00002-14: Resistor
  R84 R85 R88: Value: 1k
  R86 R89 R91: Value: 100k
  R90: Value: 10k
R87 = CMP-2000-00869-1: Manufacturer: Panasonic; Part Number: ERT-J1VR103J
U9 = CMP-0069-00195-3: SIMPLE SWITCHER® High Efficiency 5A Step-Down Voltage Regulator, 7-pin TO-263, Pb-Free; Manufacturer: Texas Instruments; PackageTopMarking: NSUZXYTTE#*LM2678*S-3.3; PowerWise: N; PackageReference: KTW0007B; Code_JEDEC: MO-169-AC; CompType: Switcher; RoHS: Y; PackageDescription: TO-263, Molded, .400 x .390 x .180in Body, 7 Lead, .050in Pitch, Surface Mount; ComponentLink1Description: Datasheet URL; PinCount: 7; ComponentLink1URL: http://www.ti.com/general/docs/lit/getliterature.tsp?genericPartNumber=LM2678&fileType=pdf
U10 = CMP-1557-00012-2: SENSOR CURRENT HALL 12.5A AC/DC; Number of Channels: 1; Min Supply Voltage: 3V; Sensitivity: 110mV/A; Response Time: 4.6us; Operating Supply Voltage: 3.3V; Max Supply Voltage: 5.5V; Max Supply Current: 5.5mA; Bandwidth: 100kHz; Linearity: 1%; Quiescent Current: 4mA; Accuracy: 5%; Polarity: Bidirectional; Case/Package: SOIC; Packaging: Tape and Reel; Number of Pins: 8; Width: 3.9mm; Frequency: 100kHz; -3db Bandwidth: 100kHz; REACH SVHC: No SVHC; Series: -; Height: 1.5mm; Package Quantity: 1; Min Operating Temperature: -40°C; Max Operating Temperature: 125°C; Current Sensing: 12.5A; RoHS Compliant: Yes; Length: 4.9mm

## Nets that join several sheets
3V3_AUX: HU_revB (R8.1 R9.1), TCAN1146_PWR_MGMT (C2.1 R11.2 U1.8), 5V_REG (C10.1 R28.1 R33.2 U4.8), NVME (F10.1), MCP2515_PINOUT (5 pins), ADC108S022_PINOUT (7 pins), SD (Q10.5 Q10.6 R59.2), 3V3_REG (7 pins)
5V_MAIN: HU_revB (9 pins), TCAN1146_PWR_MGMT (C3.1 U2.3), 5V_REG (R34.2 U4.3 U4.4)
ACC_12V: HU_revB (J1.24), TCAN1146_PWR_MGMT (R22.1)
BAT_12V: HU_revB (J1.1 J1.2 J1.13 J1.14), TCAN1146_PWR_MGMT (XF1.1 XF1.2)
GND: HU_revB (154 pins), TCAN1146_PWR_MGMT (19 pins), 5V_REG (15 pins), NVME (33 pins), MCP2515_PINOUT (7 pins), ADC108S022_PINOUT (11 pins), SD (9 pins), 3V3_REG (16 pins)
PWR_OUT: HU_revB (F3.1 F5.1 F6.1 F7.1), TCAN1146_PWR_MGMT (D17.2 R13.2 U1.3 U1.4)
CAN_N: HU_revB (J1.29), TCAN1146_PWR_MGMT (C6.1 D4.2 L1.4 R21.2)
CAN_P: HU_revB (J1.28), TCAN1146_PWR_MGMT (C8.2 D4.1 L1.1 R24.1)
NetC12_1: HU_revB (F3.2), 5V_REG (5 pins)
NetC62_1: HU_revB (F5.2), 3V3_REG (5 pins)
NetD2_1: TCAN1146_PWR_MGMT (D2.1 R13.1 R14.2), ADC108S022_PINOUT (U6.4)
NetR10_1: TCAN1146_PWR_MGMT (R10.1), ADC108S022_PINOUT (U6.5)
NetR28_2: 5V_REG (R28.2 R31.2), ADC108S022_PINOUT (U6.8)
NetR32_1: 5V_REG (R32.1), ADC108S022_PINOUT (U6.7)
NetR34_1: 5V_REG (R34.1 R35.2), ADC108S022_PINOUT (U6.6)
NetR84_2: ADC108S022_PINOUT (U6.11), 3V3_REG (R84.2 R87.2)
NetR88_1: ADC108S022_PINOUT (U6.10), 3V3_REG (R88.1)
NetR90_1: ADC108S022_PINOUT (U6.9), 3V3_REG (R90.1 R91.2)
NetU2_1: TCAN1146_PWR_MGMT (U2.1), MCP2515_PINOUT (U5.1)
NetU2_4: TCAN1146_PWR_MGMT (U2.4), MCP2515_PINOUT (U5.2)